# EAGLE design piezo_amplifier (EAGLE 9.3.0)
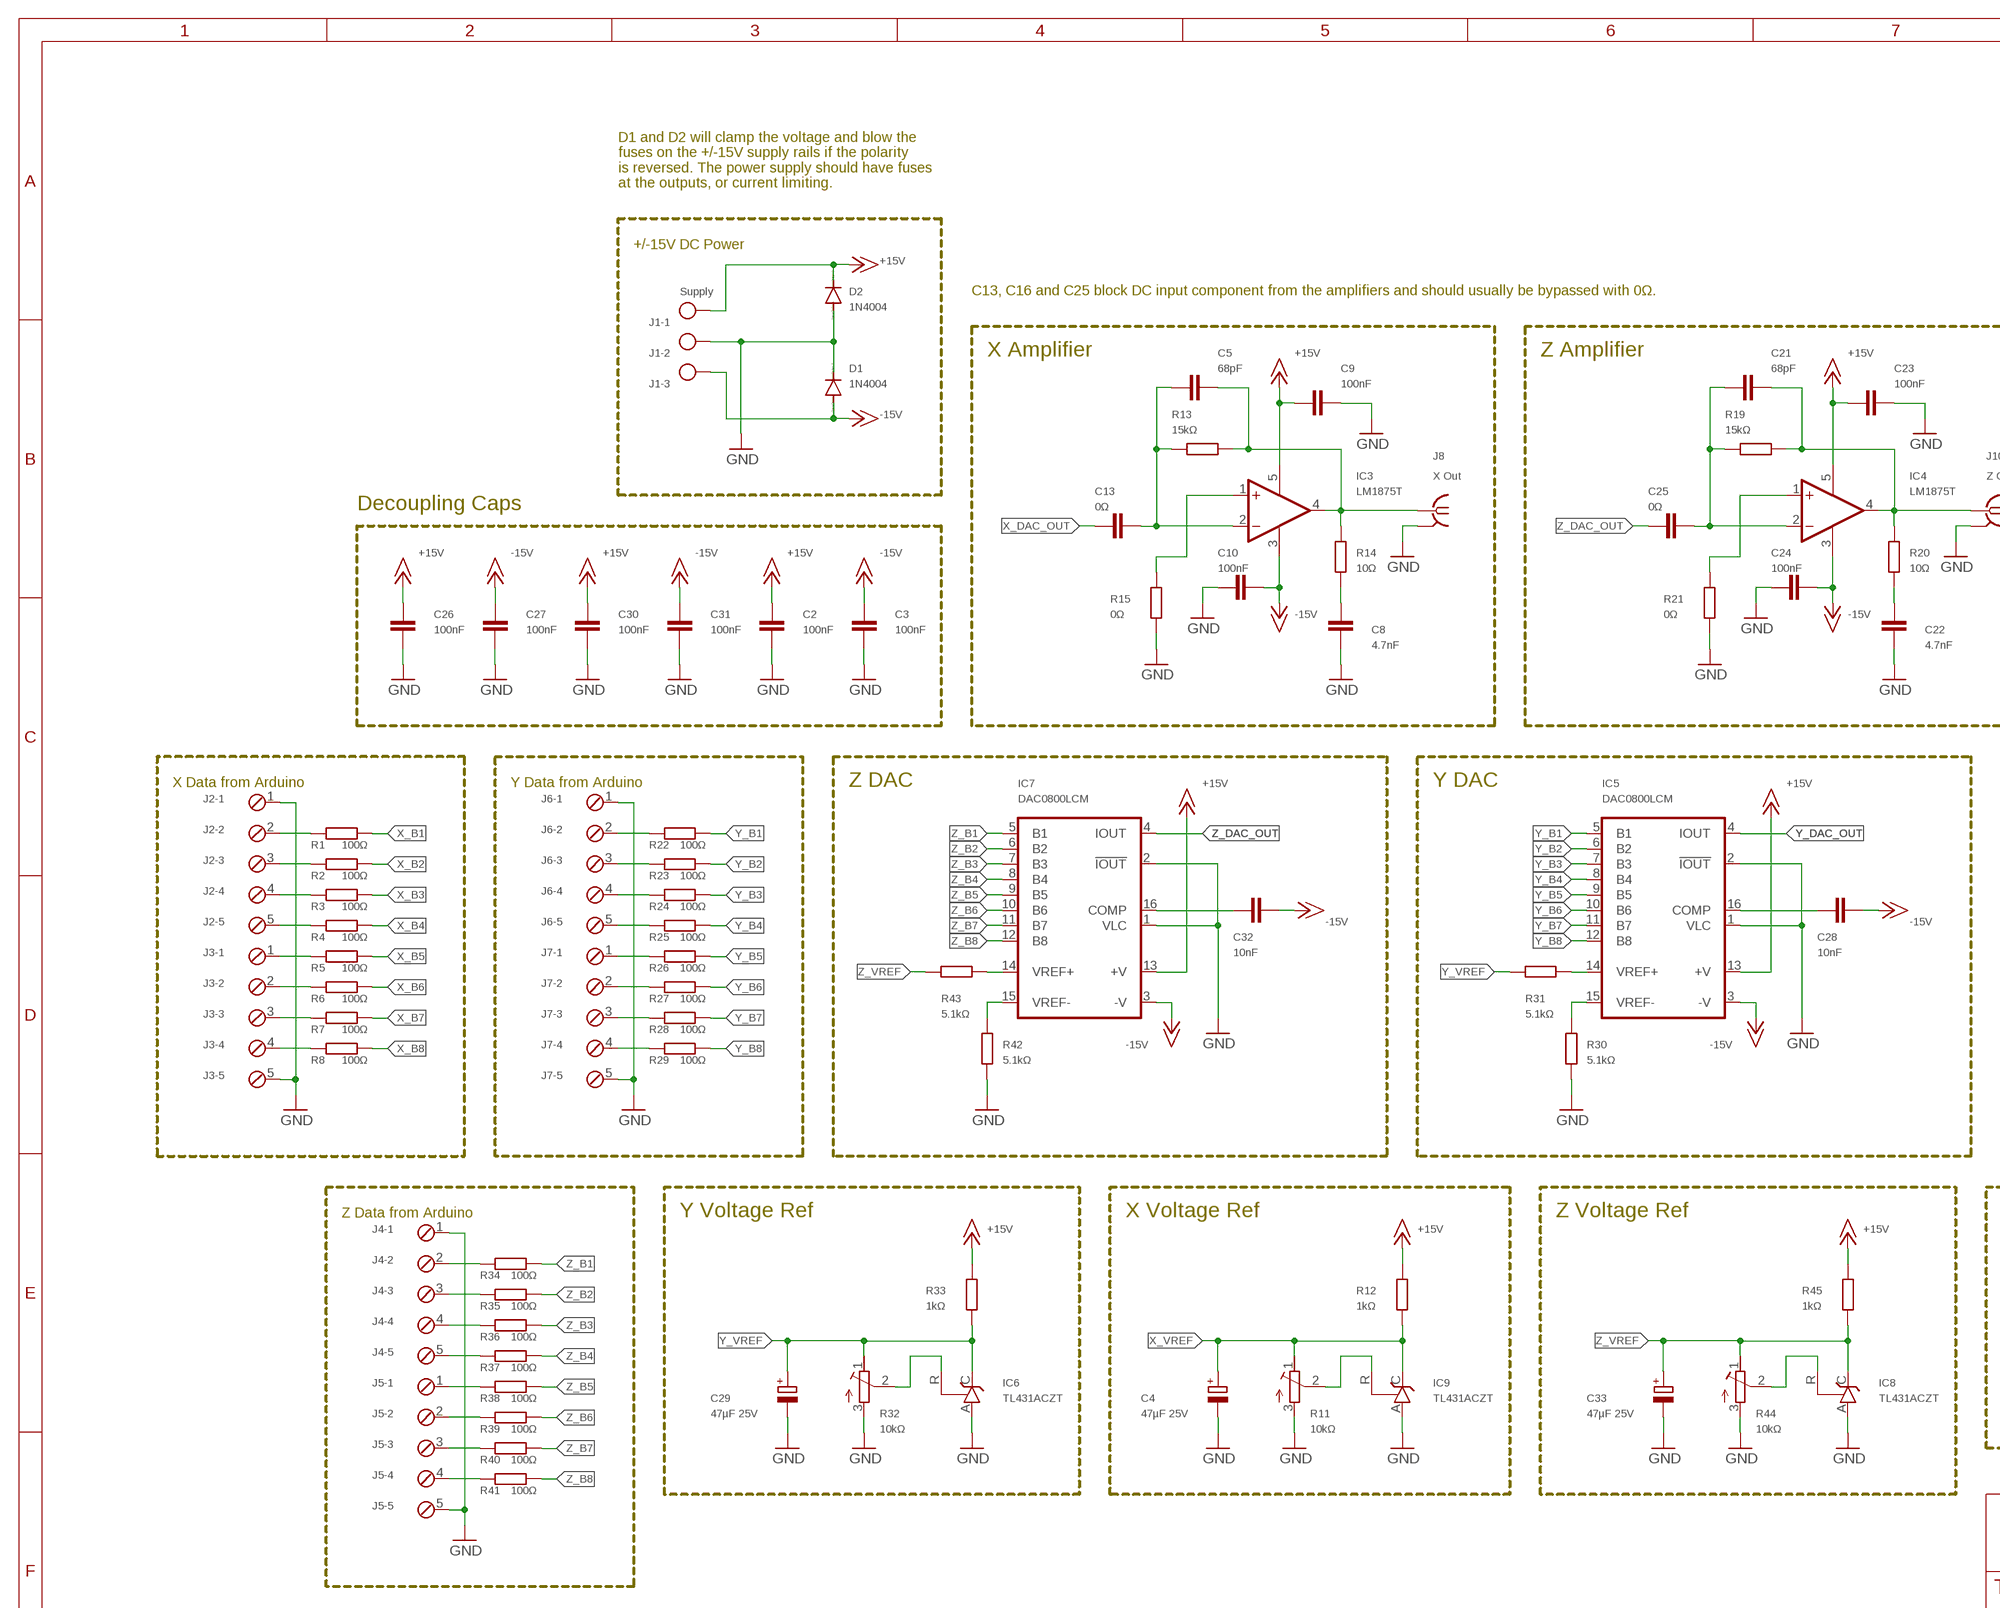
[diagram p0: schematic, sheet 1, part 1 of 3]
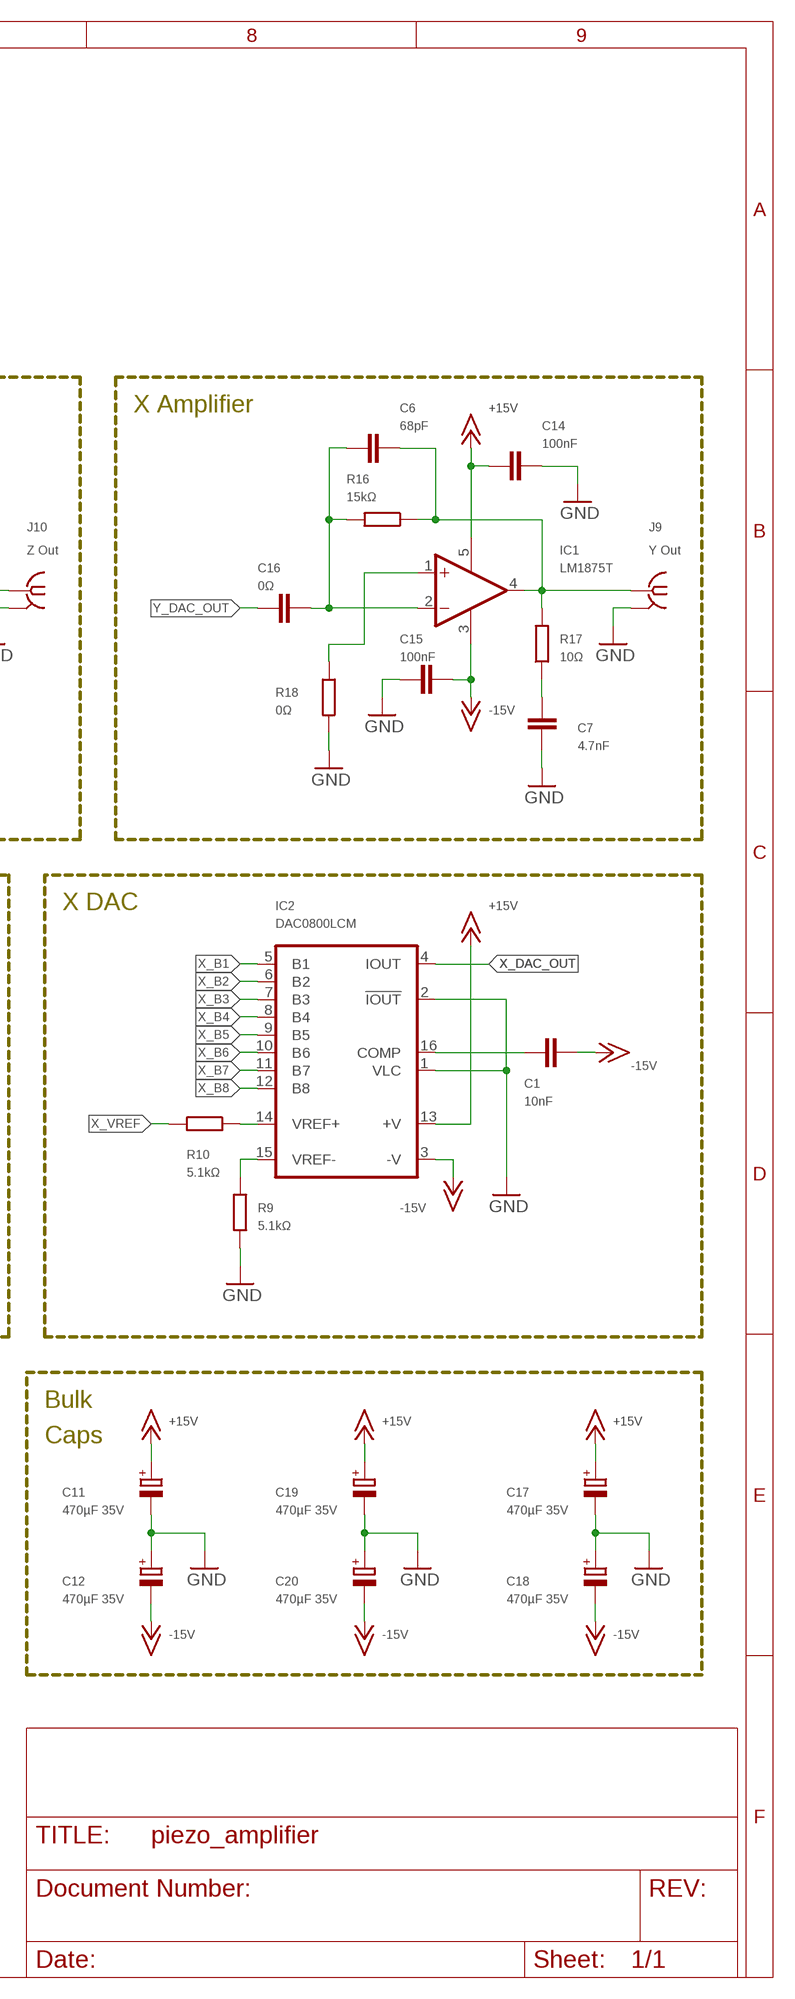
[diagram p1: schematic, sheet 1, part 2 of 3]
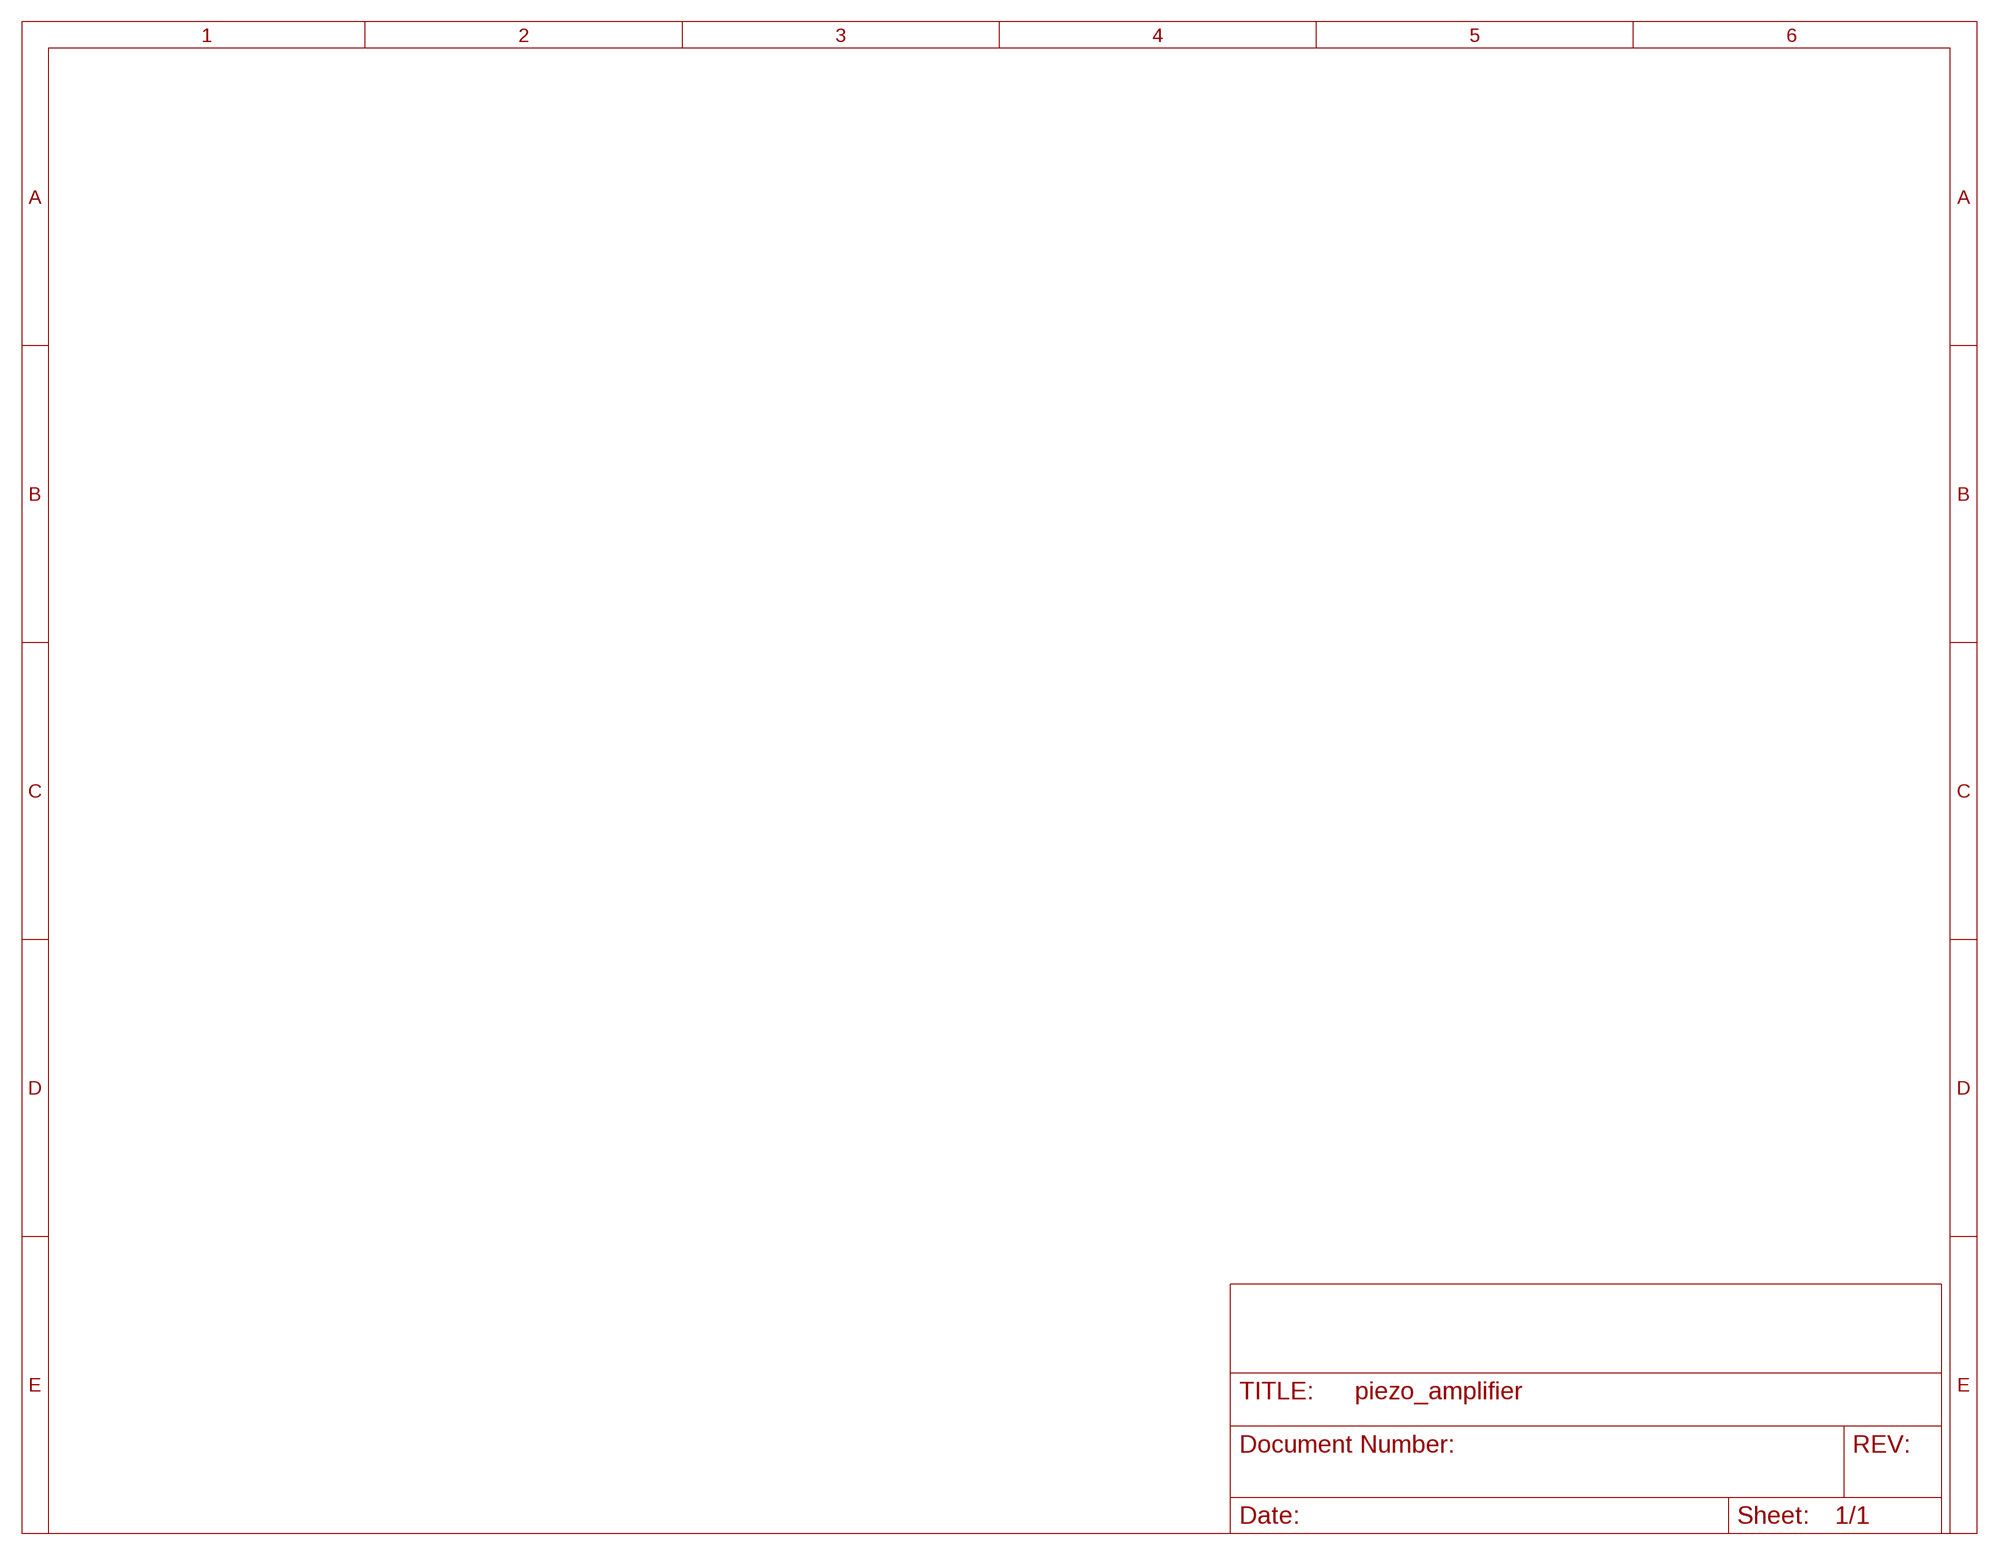
[diagram p2: schematic, sheet 1, part 3 of 3]

## Parts
C1  10nF  C-EU050-025X075  [C050-025X075]
C2  100nF  C-EU050-025X075  [C050-025X075]
C3  100nF  C-EU050-025X075  [C050-025X075]
C4  47µF 25V  CPOL-EUE2.5-5  [E2,5-5]
C5  68pF  C-EU050-025X075  [C050-025X075]
C6  68pF  C-EU050-025X075  [C050-025X075]
C7  4.7nF  C-EU050-025X075  [C050-025X075]
C8  4.7nF  C-EU050-025X075  [C050-025X075]
C9  100nF  C-EU050-025X075  [C050-025X075]
C10  100nF  C-EU050-025X075  [C050-025X075]
C11  470µF 35V  CPOL-EUE5-8.5  [E5-8,5]
C12  470µF 35V  CPOL-EUE5-8.5  [E5-8,5]
C13  0Ω  C-EU050-025X075  [C050-025X075]
C14  100nF  C-EU050-025X075  [C050-025X075]
C15  100nF  C-EU050-025X075  [C050-025X075]
C16  0Ω  C-EU050-025X075  [C050-025X075]
C17  470µF 35V  CPOL-EUE5-8.5  [E5-8,5]
C18  470µF 35V  CPOL-EUE5-8.5  [E5-8,5]
C19  470µF 35V  CPOL-EUE5-8.5  [E5-8,5]
C20  470µF 35V  CPOL-EUE5-8.5  [E5-8,5]
C21  68pF  C-EU050-025X075  [C050-025X075]
C22  4.7nF  C-EU050-025X075  [C050-025X075]
C23  100nF  C-EU050-025X075  [C050-025X075]
C24  100nF  C-EU050-025X075  [C050-025X075]
C25  0Ω  C-EU050-025X075  [C050-025X075]
C26  100nF  C-EU050-025X075  [C050-025X075]
C27  100nF  C-EU050-025X075  [C050-025X075]
C28  10nF  C-EU050-025X075  [C050-025X075]
C29  47µF 25V  CPOL-EUE2.5-5  [E2,5-5]
C30  100nF  C-EU050-025X075  [C050-025X075]
C31  100nF  C-EU050-025X075  [C050-025X075]
C32  10nF  C-EU050-025X075  [C050-025X075]
C33  47µF 25V  CPOL-EUE2.5-5  [E2,5-5]
D1  1N4004  [DO41-10]
D2  1N4004  [DO41-10]
IC1  LM1875T  [CB367]
IC2  DAC0800LCM  DAC0800D  [SO16]
IC3  LM1875T  [CB367]
IC4  LM1875T  [CB367]
IC5  DAC0800LCM  DAC0800D  [SO16]
IC6  TL431ACZT  TL431CLP  [TO92-CLP]
IC7  DAC0800LCM  DAC0800D  [SO16]
IC8  TL431ACZT  TL431CLP  [TO92-CLP]
IC9  TL431ACZT  TL431CLP  [TO92-CLP]
J1  Supply  MKDSN1,5/3-5,08  [MKDSN1,5/3-5,08]
J2  MPT5  [5POL254]
J3  MPT5  [5POL254]
J4  MPT5  [5POL254]
J5  MPT5  [5POL254]
J6  MPT5  [5POL254]
J7  MPT5  [5POL254]
J8  X Out  BU-SMA-V  [BU-SMA-V]
J9  Y Out  BU-SMA-V  [BU-SMA-V]
J10  Z Out  BU-SMA-V  [BU-SMA-V]
R1  100Ω  R-EU_0207/10  [0207/10]
R2  100Ω  R-EU_0207/10  [0207/10]
R3  100Ω  R-EU_0207/10  [0207/10]
R4  100Ω  R-EU_0207/10  [0207/10]
R5  100Ω  R-EU_0207/10  [0207/10]
R6  100Ω  R-EU_0207/10  [0207/10]
R7  100Ω  R-EU_0207/10  [0207/10]
R8  100Ω  R-EU_0207/10  [0207/10]
R9  5.1kΩ  R-EU_0207/10  [0207/10]
R10  5.1kΩ  R-EU_0207/10  [0207/10]
R11  10kΩ  R-TRIMMT93YA  [RTRIMT93YA]
R12  1kΩ  R-EU_0207/10  [0207/10]
R13  15kΩ  R-EU_0207/10  [0207/10]
R14  10Ω  R-EU_0207/10  [0207/10]
R15  0Ω  R-EU_0207/10  [0207/10]
R16  15kΩ  R-EU_0207/10  [0207/10]
R17  10Ω  R-EU_0207/10  [0207/10]
R18  0Ω  R-EU_0207/10  [0207/10]
R19  15kΩ  R-EU_0207/10  [0207/10]
R20  10Ω  R-EU_0207/10  [0207/10]
R21  0Ω  R-EU_0207/10  [0207/10]
R22  100Ω  R-EU_0207/10  [0207/10]
R23  100Ω  R-EU_0207/10  [0207/10]
R24  100Ω  R-EU_0207/10  [0207/10]
R25  100Ω  R-EU_0207/10  [0207/10]
R26  100Ω  R-EU_0207/10  [0207/10]
R27  100Ω  R-EU_0207/10  [0207/10]
R28  100Ω  R-EU_0207/10  [0207/10]
R29  100Ω  R-EU_0207/10  [0207/10]
R30  5.1kΩ  R-EU_0207/10  [0207/10]
R31  5.1kΩ  R-EU_0207/10  [0207/10]
R32  10kΩ  R-TRIMMT93YA  [RTRIMT93YA]
R33  1kΩ  R-EU_0207/10  [0207/10]
R34  100Ω  R-EU_0207/10  [0207/10]
R35  100Ω  R-EU_0207/10  [0207/10]
R36  100Ω  R-EU_0207/10  [0207/10]
R37  100Ω  R-EU_0207/10  [0207/10]
R38  100Ω  R-EU_0207/10  [0207/10]
R39  100Ω  R-EU_0207/10  [0207/10]
R40  100Ω  R-EU_0207/10  [0207/10]
R41  100Ω  R-EU_0207/10  [0207/10]
R42  5.1kΩ  R-EU_0207/10  [0207/10]
R43  5.1kΩ  R-EU_0207/10  [0207/10]
R44  10kΩ  R-TRIMMT93YA  [RTRIMT93YA]
R45  1kΩ  R-EU_0207/10  [0207/10]

## Nets
+15V: C2.2 C9.1 C11.+ C14.1 C17.+ C19.+ C23.1 C26.2 C30.2 D2.C IC1.5(V+) IC2.13(+V) IC3.5(V+) IC4.5(V+) IC5.13(+V) IC7.13(+V) J1.1 R12.2 R33.2 R45.2
-15V: C1.2 C3.2 C10.2 C12.- C15.2 C18.- C20.- C24.2 C27.2 C28.2 C31.2 C32.2 D1.A IC1.3(V-) IC2.3(-V) IC3.3(V-) IC4.3(V-) IC5.3(-V) IC7.3(-V) J1.3
FOO: C6.2 C16.1 IC1.2(-IN) R16.2
FOO1: C21.2 C25.1 IC4.2(-IN) R19.2
FOO2: C5.2 C13.1 IC3.2(-IN) R13.2
GND: C2.1 C3.1 C4.- C7.2 C8.2 C9.2 C10.1 C11.- C12.+ C14.2 C15.1 C17.- C18.+ C19.- C20.+ C22.2 C23.2 C24.1 C26.1 C27.1 C29.- C30.1 C31.1 C33.- D1.C D2.A IC2.1(VLC) IC2.2(!IOUT) IC5.1(VLC) IC5.2(!IOUT) IC6.A IC7.1(VLC) IC7.2(!IOUT) IC8.A IC9.A J1.2 J2.1 J3.5 J4.1 J5.5 J6.1 J7.5 J8.2 J8.3 J8.4 J8.5 J9.2 J9.3 J9.4 J9.5 J10.2 J10.3 J10.4 J10.5 R9.1 R11.3(A) R15.2 R18.2 R21.2 R30.1 R32.3(A) R42.1 R44.3(A)
N$1: IC9.R R11.2(S)
N$2: C5.1 IC3.4(OUT) J8.1 R13.1 R14.2
N$3: C6.1 IC1.4(OUT) J9.1 R16.1 R17.2
N$4: C8.1 R14.1
N$5: IC3.1(+IN) R15.1
N$6: C7.1 R17.1
N$7: IC1.1(+IN) R18.1
N$8: C21.1 IC4.4(OUT) J10.1 R19.1 R20.2
N$9: J2.3 R2.1
N$10: J2.2 R1.1
N$11: J2.4 R3.1
N$12: J2.5 R4.1
N$13: J3.1 R5.1
N$14: J3.2 R6.1
N$15: J3.3 R7.1
N$16: J3.4 R8.1
N$17: C22.1 R20.1
N$18: IC4.1(+IN) R21.1
N$19: J6.2 R22.1
N$20: J6.3 R23.1
N$21: J6.4 R24.1
N$22: J6.5 R25.1
N$23: J7.1 R26.1
N$24: J7.2 R27.1
N$25: C1.1 IC2.16(COMP)
N$26: J7.3 R28.1
N$27: J7.4 R29.1
N$28: IC2.14(VREF+) R10.1
N$29: IC2.15(VREF-) R9.2
N$30: C28.1 IC5.16(COMP)
N$31: IC5.14(VREF+) R31.1
N$32: IC5.15(VREF-) R30.2
N$33: IC6.R R32.2(S)
N$34: J4.2 R34.1
N$35: J4.3 R35.1
N$36: J4.4 R36.1
N$37: J4.5 R37.1
N$38: J5.1 R38.1
N$39: J5.2 R39.1
N$40: J5.3 R40.1
N$41: J5.4 R41.1
N$42: C32.1 IC7.16(COMP)
N$43: IC7.14(VREF+) R43.1
N$44: IC7.15(VREF-) R42.2
N$45: IC8.R R44.2(S)
X_B1: IC2.5(B1) R1.2
X_B2: IC2.6(B2) R2.2
X_B3: IC2.7(B3) R3.2
X_B4: IC2.8(B4) R4.2
X_B5: IC2.9(B5) R5.2
X_B6: IC2.10(B6) R6.2
X_B7: IC2.11(B7) R7.2
X_B8: IC2.12(B8) R8.2
X_DAC_OUT: C13.2 IC2.4(IOUT)
X_VREF: C4.+ IC9.C R10.2 R11.1(E) R12.1
Y_B1: IC5.5(B1) R22.2
Y_B2: IC5.6(B2) R23.2
Y_B3: IC5.7(B3) R24.2
Y_B4: IC5.8(B4) R25.2
Y_B5: IC5.9(B5) R26.2
Y_B6: IC5.10(B6) R27.2
Y_B7: IC5.11(B7) R28.2
Y_B8: IC5.12(B8) R29.2
Y_DAC_OUT: C16.2 IC5.4(IOUT)
Y_VREF: C29.+ IC6.C R31.2 R32.1(E) R33.1
Z_B1: IC7.5(B1) R34.2
Z_B2: IC7.6(B2) R35.2
Z_B3: IC7.7(B3) R36.2
Z_B4: IC7.8(B4) R37.2
Z_B5: IC7.9(B5) R38.2
Z_B6: IC7.10(B6) R39.2
Z_B7: IC7.11(B7) R40.2
Z_B8: IC7.12(B8) R41.2
Z_DAC_OUT: C25.2 IC7.4(IOUT)
Z_VREF: C33.+ IC8.C R43.2 R44.1(E) R45.1

## Notes on the sheet
- D1 and D2 will clamp the voltage and blow the
  fuses on the +/-15V supply rails if the polarity
  is reversed. The power supply should have fuses
  at the outputs, or current limiting.
- +/-15V DC Power
- C13, C16 and C25 block DC input component from the amplifiers and should usually be bypassed with 0Ω.
- X Amplifier | Z Amplifier | X Amplifier
- Decoupling Caps
- X Data from Arduino | Y Data from Arduino | Z DAC | Y DAC | X DAC
- Z Data from Arduino | Y Voltage Ref | X Voltage Ref | Z Voltage Ref | Bulk
- Caps

## Library data of the parts
C1-C3 C5-C10 C13-C16 C21-C28 C30-C32 = piezo_amplifier:C-EU: CAPACITOR, European symbol; SPICEPREFIX: C
C4 C11 C12 C17-C20 C29 C33 = piezo_amplifier:CPOL-EU: POLARIZED CAPACITOR, European symbol; SPICEPREFIX: C
D1 D2 = piezo_amplifier:1N4004: DIODE general purpose rectifier, 1 A
IC1 IC3 IC4 = piezo_amplifier:LM1875T: Power OP AMP
IC2 IC5 IC7 = piezo_amplifier:DAC0800: 8-bit DIGITAL/ANALOG CONVERTER
IC6 IC8 IC9 = piezo_amplifier:TL431CLP: VOLTAGE REGULATOR
J1 = piezo_amplifier:MKDSN1,5/3-5,08: MKDSN 1,5/ 3-5,08 Printklemme Nennstrom: 13,5 A Nennspannung: 250 V Rastermaß: 5,08 mm Polzahl: 3 Anschlussart: Schraubanschluss Montage: Löten Anschlussrichtung Leiter/Platine: 0 ° Artikelnummer: 1729131 Source: http://eshop.phoenixcontact.com .. 1729131.pdf
J2-J7 = piezo_amplifier:MPT5: PHOENIX CONNECTOR; OC_FARNELL: unknown; OC_NEWARK: unknown
J8-J10 = con-coax:BU-SMA-V: FEMALE SMA CONNECTOR Radiall distributor RS 112-3794; OC_FARNELL: unknown; OC_NEWARK: unknown
R1-R10 R12-R31 R33-R43 R45 = piezo_amplifier:R-EU_: RESISTOR, European symbol; SPICEPREFIX: R
R11 R32 R44 = piezo_amplifier:R-TRIMM: Trimm resistor; SPICEMODEL: X; SPICEPREFIXL: POT

## Board
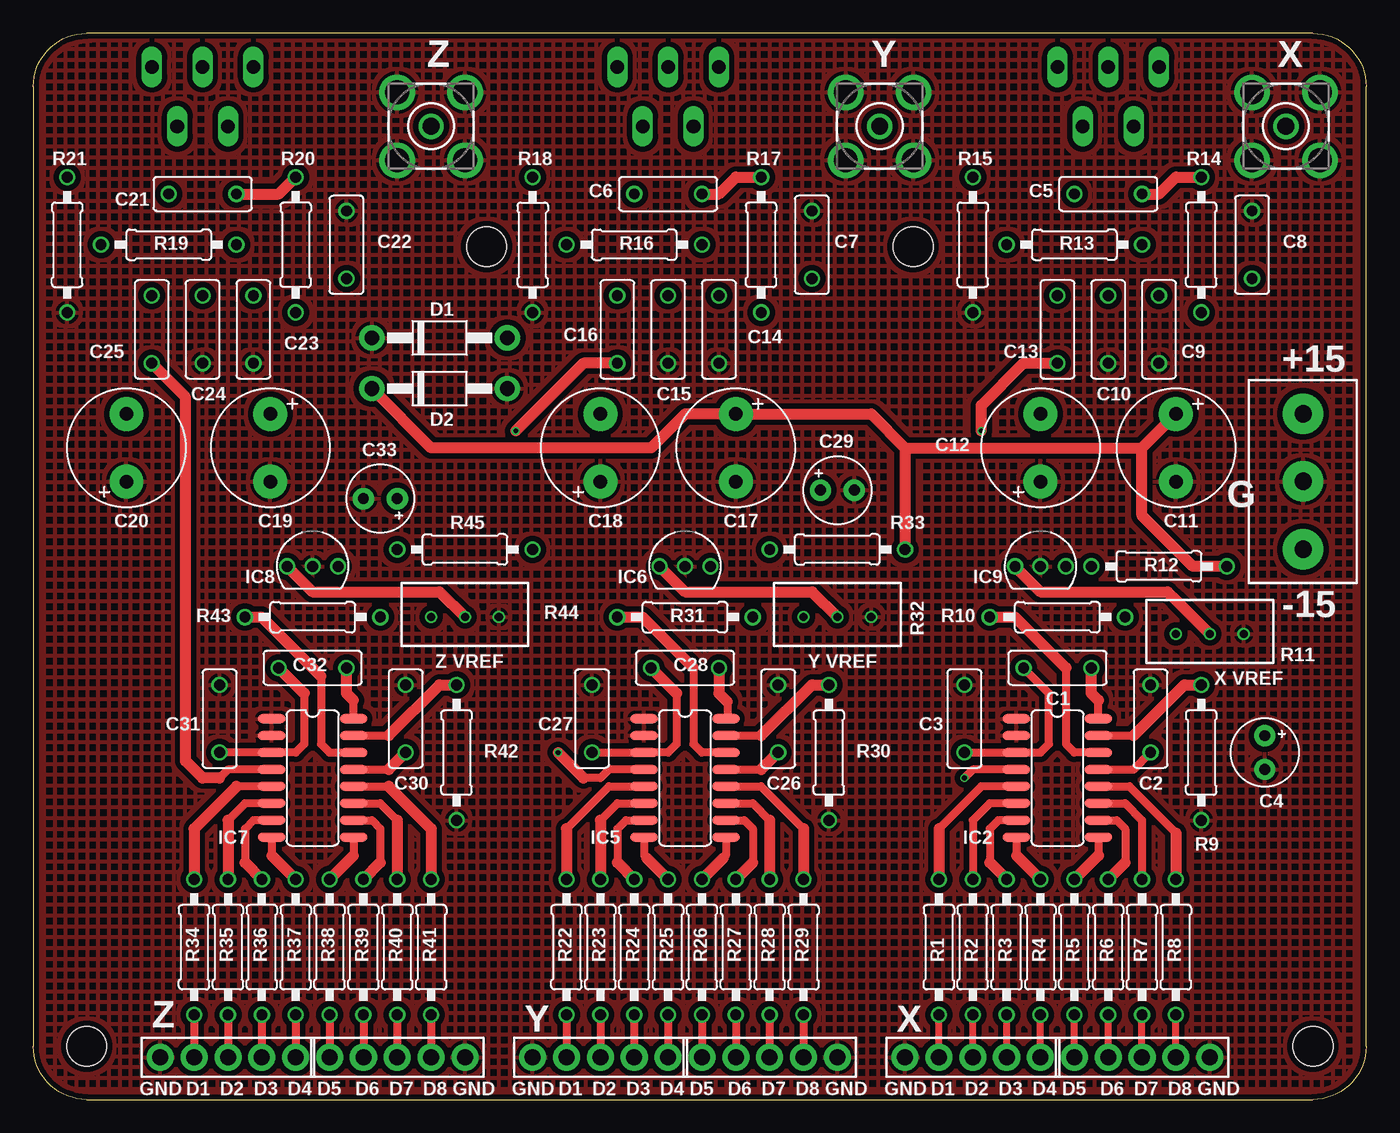
[diagram p3: board, top side]
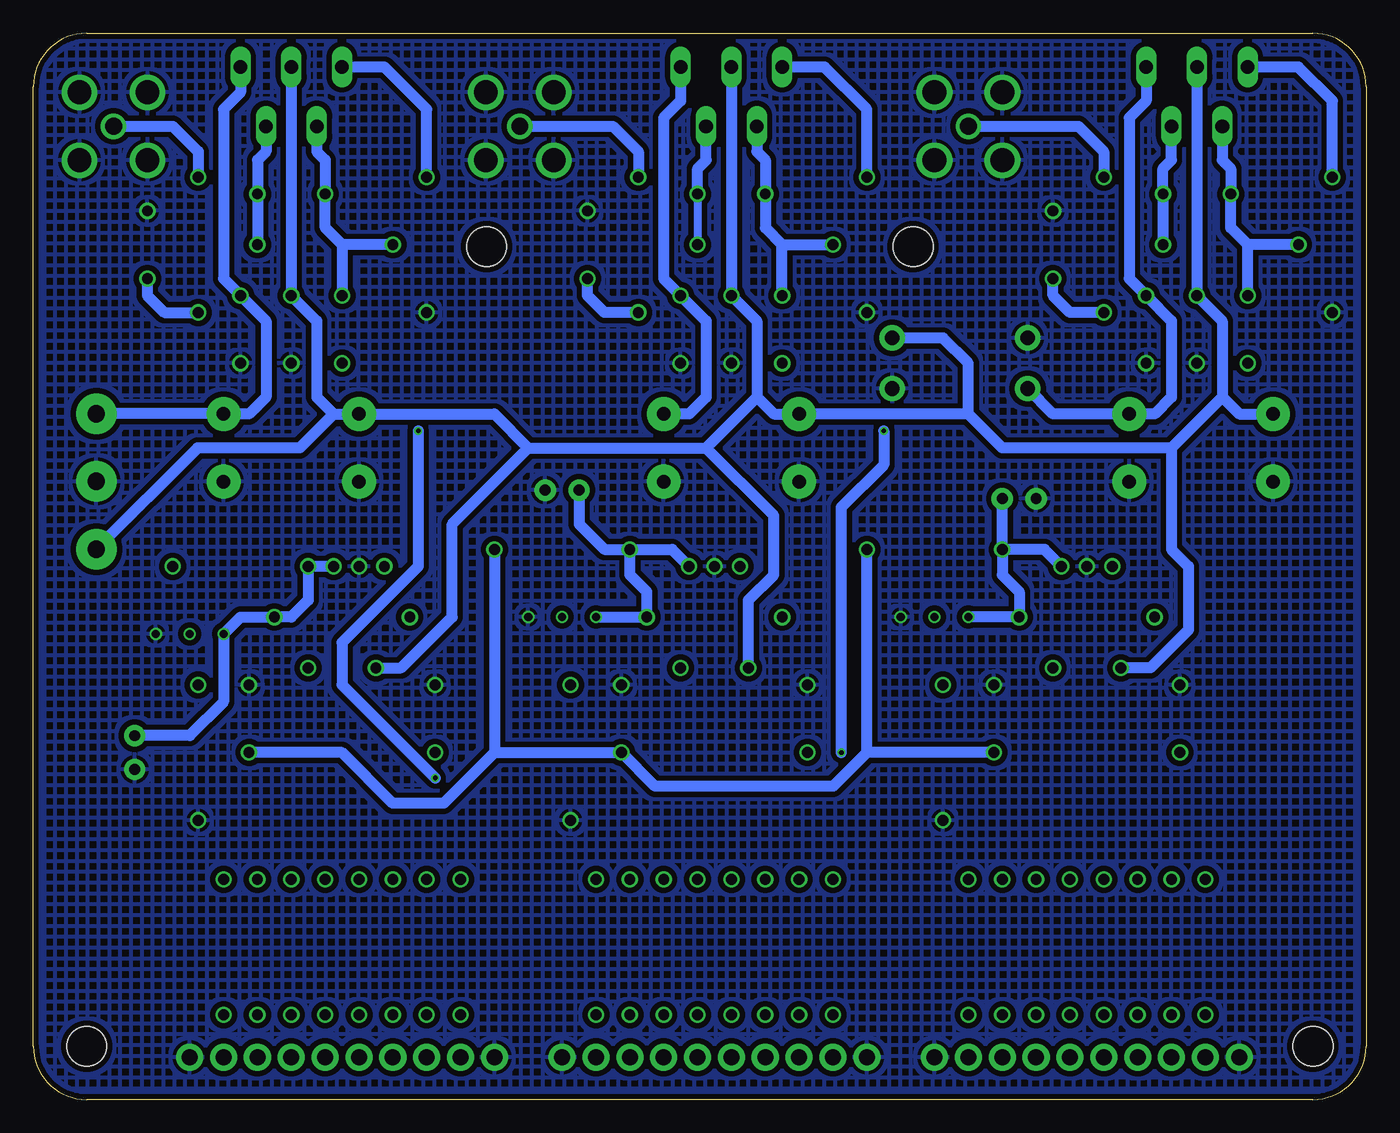
[diagram p4: board, bottom side, seen from below]

Size 100 x 80 mm. Coordinates in mm from the lower left corner, seen from the top.
Outline: 4,0 96,0 arc90 100,4 100,76 arc90 96,80 4,80 arc90 0,76 0,4 arc90 4,0
Copper layers (1*16): Top 0.035559375mm / dielectric 1.6mm / Bottom 0.035559375mm
Design rules "oshpark-2layer": minimum track width 6mil, minimum drill 10mil, track to track 6mil, track to pad 6mil, pad to pad 6mil, via to via 6mil, smd to smd 6mil, copper to edge 15mil, drill to drill 6mil, minimum pad ring 5mil, minimum via ring 5mil, stop-mask expansion 2.5mil, vias tented up to drill 0mil, thermal gap 10mil
Holes 3 mm at 34,64 96,4 4,4 66,64

### Footprints (pad centres in the part's own frame; a part is rotated, then mirrored left to right if it is on the bottom)
C050-025X075 = drill 0.813: 1 -2.54,0; 2 2.54,0
E2,5-5 = drill 0.813 pad 1.6: + -1.27,0; - 1.27,0
E5-8,5 = drill 1.016 pad 2.54: + -2.54,0; - 2.54,0
DO41-10 = drill 1.118 pad 1.905: A 5.08,0; C -5.08,0
CB367 = drill 1.016 long: 1 -3.81,-6.985; 2 -1.905,-11.43; 3 0,-6.985; 4 1.905,-11.43; 5 3.81,-6.985
SO16 = smd 0.66 x 2.032: 1 -4.445,-3.073; 2 -3.175,-3.073; 3 -1.905,-3.073; 4 -0.635,-3.073; 5 0.635,-3.073; 6 1.905,-3.073; 7 3.175,-3.073; 8 4.445,-3.073; 9 4.445,3.073; 10 3.175,3.073; 11 1.905,3.073; 12 0.635,3.073; 13 -0.635,3.073; 14 -1.905,3.073; 15 -3.175,3.073; 16 -4.445,3.073
TO92-CLP = drill 0.813: A 0,0; C 1.905,0; R -1.905,0
MKDSN1,5/3-5,08 = drill 1.3 pad 3.048: 1 -7.641,0.025; 2 -2.561,0.025; 3 2.519,0.025
5POL254 = drill 1.2 pad 2.032: 1 -5.08,0; 2 -2.54,0; 3 0,0; 4 2.54,0; 5 5.08,0
BU-SMA-V = drill 1.27: 1 0,0 | drill 1.778: 2 -2.55,2.55; 3 2.55,2.55; 4 2.55,-2.55; 5 -2.55,-2.55
0207/10 = drill 0.813: 1 -5.08,0; 2 5.08,0
RTRIMT93YA = drill 0.61: 1 0,-2.54; 2 0,0; 3 0,2.54

### Placement (x,y rotation side)
C1  76.83,32.38 180 top
C2  83.82,28.57 270 top
C3  69.85,28.57 270 top
C4  92.39,26.04 270 top
C5  80.64,67.94 180 top
C6  47.62,67.94 180 top
C7  58.42,64.14 90 top
C8  91.44,64.14 90 top
C9  84.45,57.78 270 top
C10  80.64,57.78 90 top
C11  85.72,48.9 270 top
C12  75.56,48.9 90 top
C13  76.83,57.78 270 top
C14  51.44,57.78 270 top
C15  47.62,57.78 90 top
C16  43.81,57.78 270 top
C17  52.7,48.9 270 top
C18  42.55,48.9 90 top
C19  17.78,48.9 270 top
C20  6.99,48.9 90 top
C21  12.7,67.94 180 top
C22  23.5,64.14 90 top
C23  16.51,57.78 270 top
C24  12.7,57.78 90 top
C25  8.89,57.78 270 top
C26  55.88,28.57 270 top
C27  41.91,28.57 270 top
C28  48.9,32.38 180 top
C29  60.33,45.72 0 top
C30  27.94,28.57 270 top
C31  13.97,28.57 270 top
C32  20.95,32.38 180 top
C33  26.04,45.09 180 top
D1  30.48,57.15 0 top
D2  30.48,53.34 0 top
IC1  47.62,84.45 0 top
IC2  76.83,24.13 270 top
IC3  80.64,84.45 0 top
IC4  12.7,84.45 0 top
IC5  48.9,24.13 270 top
IC6  48.9,40.01 0 top
IC7  20.95,24.13 270 top
IC8  20.95,40.01 0 top
IC9  75.56,40.01 0 top
J1  95.25,43.81 270 top
J2  70.48,3.17 0 top
J3  83.19,3.17 0 top
J4  14.61,3.17 0 top
J5  27.3,3.17 0 top
J6  42.55,3.17 0 top
J7  55.24,3.17 0 top
J8  93.98,73.03 0 top
J9  63.5,73.03 0 top
J10  29.84,73.03 0 top
R1  67.94,11.43 90 top
R2  70.48,11.43 90 top
R3  73.03,11.43 90 top
R4  75.56,11.43 90 top
R5  78.11,11.43 90 top
R6  80.64,11.43 90 top
R7  83.19,11.43 90 top
R8  85.72,11.43 90 top
R9  87.63,26.04 90 top
R10  76.83,36.2 0 top
R11  88.27,34.92 270 top
R12  84.45,40.01 0 top
R13  78.11,64.14 180 top
R14  87.63,64.14 90 top
R15  70.48,64.14 270 top
R16  45.09,64.14 180 top
R17  54.61,64.14 90 top
R18  37.47,64.14 270 top
R19  10.16,64.14 180 top
R20  19.68,64.14 90 top
R21  2.54,64.14 270 top
R22  40.01,11.43 90 top
R23  42.55,11.43 90 top
R24  45.09,11.43 90 top
R25  47.62,11.43 90 top
R26  50.16,11.43 90 top
R27  52.7,11.43 90 top
R28  55.24,11.43 90 top
R29  57.78,11.43 90 top
R30  59.69,26.04 90 top
R31  48.9,36.2 0 top
R32  60.33,36.2 270 top
R33  60.33,41.27 0 top
R34  12.06,11.43 90 top
R35  14.61,11.43 90 top
R36  17.14,11.43 90 top
R37  19.68,11.43 90 top
R38  22.23,11.43 90 top
R39  24.77,11.43 90 top
R40  27.3,11.43 90 top
R41  29.84,11.43 90 top
R42  31.75,26.04 90 top
R43  20.95,36.2 0 top
R44  32.38,36.2 270 top
R45  32.38,41.27 0 top

### Tracks (layer width: path | path; a pad name or v marks a point on that pad's centre or on a via)
+15V
  Top 0.61: IC2.13 82.55,24.77 C2.2 | IC5.13 54.61,24.77 | IC7.13 26.67,24.77
  Top 0.813: D2.C 29.84,48.9 46.35,48.9 48.9,51.44 C17.+ 62.87,51.44 65.41,48.9 | 65.41,48.9 83.19,48.9 | 83.19,48.9 C11.+ | 54.61,24.77 C26.2 | 26.67,24.77 C30.2 | R12.2 87,40.01 83.19,43.81 83.19,48.9 | 65.41,48.9 R33.2
  Bottom 0.61: C11.+ 85.75,51.46
  Bottom 0.813: C11.+ 83.82,51.44 82.55,52.7 82.55,58.42 C9.1 85.72,61.59 85.72,74.3 84.45,75.56 IC3.5 | C17.+ 50.8,51.44 49.53,52.7 49.53,58.42 C14.1 52.7,61.59 52.7,73.66 51.44,74.93 IC1.5 | 85.75,51.46 J1.1 | C30.2 37.47,26.04 | 37.47,26.04 40.01,23.5 53.34,23.5 C26.2 65.41,26.04 | 37.47,26.04 R45.2 | R33.2 65.41,26.04 | 65.41,26.04 69.22,22.23 73.03,22.23 76.83,26.04 C2.2 | D2.C 23.5,51.44 C19.+ 15.88,51.44 14.61,52.7 14.61,58.42 C23.1 17.78,61.59 17.78,73.66 16.51,74.93 IC4.5
-15V
  Top 0.61: C1.2 76.2,30.48 76.2,26.67 75.56,26.04 IC2.3 C3.2 | C27.2 IC5.3 47.62,26.04 48.26,26.67 48.26,30.48 | C31.2 IC7.3 19.68,26.04 20.32,26.67 20.32,30.48
  Top 0.813: C28.2 48.26,30.48 | C32.2 20.32,30.48
  Bottom 0.813: IC3.3 C10.2 78.74,58.42 78.74,52.7 77.47,51.44 | 77.47,51.44 C12.- 65.41,51.44 62.87,48.9 | IC1.3 C15.2 45.72,58.42 45.72,52.7 | 45.72,52.7 44.45,51.44 C18.- 29.84,51.44 | 10.79,52.7 9.53,51.44 C20.- | 10.79,52.7 10.79,58.42 C24.2 IC4.3 | 10.79,52.7 14.61,48.9 | 29.84,51.44 27.3,48.9 14.61,48.9 | 45.72,52.7 49.53,48.9 | 62.87,48.9 49.53,48.9 | 77.47,51.44 80.01,48.9 87.68,48.9 J1.3 | C1.2 72.39,32.38 68.58,36.2 68.58,43.18 62.87,48.9 | 14.61,48.9 14.61,41.27 13.34,40.01 13.34,35.24 16.19,32.38 C32.2 | C28.2 46.35,37.47 44.45,39.37 44.45,43.81 49.53,48.9 | 29.84,51.44 29.84,55.24 31.75,57.15 D1.A
FOO
  Bottom 0.813: IC1.2 45.72,71.12 45.09,70.48 C6.2 45.09,65.41 43.81,64.14 | 43.81,64.14 R16.2 | C16.1 43.81,64.14
FOO1
  Bottom 0.813: C25.1 8.89,64.14 | 8.89,64.14 10.16,65.41 C21.2 10.16,69.85 10.79,70.48 IC4.2 | R19.2 8.89,64.14
FOO2
  Bottom 0.813: IC3.2 78.74,71.12 78.11,70.48 C5.2 78.11,65.41 76.83,64.14 | R13.2 76.83,64.14 | 76.83,64.14 C13.1
GND
  pour Top (isolate 0.406, hatched): 0,80 100,80 100,0 0,0
  pour Bottom (isolate 0.406, hatched): 0,80 100,80 100,0 0,0
N$1
  Top 0.813: R11.2 85.72,37.47 85.09,38.1 75.56,38.1 IC9.R
N$2
  Top 0.813: C5.1 84.45,67.94 85.72,69.22 R14.2
  Bottom 0.813: IC3.4 82.55,71.12 83.19,70.48 C5.1 R13.1 | J8.1 89.53,73.03 87.63,71.12 R14.2
N$3
  Top 0.813: C6.1 51.44,67.94 52.7,69.22 R17.2
  Bottom 0.61: C6.1 R16.1
  Bottom 0.813: C6.1 50.16,69.85 49.53,70.48 IC1.4 | J9.1 56.52,73.03 54.61,71.12 R17.2
N$4
  Bottom 0.813: C8.1 91.44,60.33 90.17,59.05 R14.1
N$5
  Bottom 0.813: R15.1 70.48,74.3 73.66,77.47 IC3.1
N$6
  Bottom 0.813: R17.1 57.15,59.05 58.42,60.33 C7.1
N$7
  Bottom 0.813: R18.1 37.47,74.3 40.64,77.47 IC1.1
N$8
  Top 0.813: C21.1 18.41,67.94 R20.2
  Bottom 0.813: R19.1 C21.1 15.24,69.85 14.61,70.48 IC4.4 | J10.1 21.59,73.03 19.68,71.12 R20.2
N$9
  Top 0.508: J2.3 R2.1
N$10
  Top 0.508: J2.2 R1.1
N$11
  Top 0.508: J2.4 R3.1
N$12
  Top 0.508: J2.5 R4.1
N$13
  Top 0.508: J3.1 R5.1
N$14
  Top 0.508: J3.2 R6.1
N$15
  Top 0.508: J3.3 R7.1
N$16
  Top 0.508: J3.4 R8.1
N$17
  Bottom 0.813: R20.1 22.23,59.05 23.5,60.33 C22.1
N$18
  Bottom 0.813: R21.1 2.54,74.93 5.08,77.47 IC4.1
N$19
  Top 0.61: R22.1 J6.2
N$20
  Top 0.61: R23.1 J6.3
N$21
  Top 0.61: R24.1 J6.4
N$22
  Top 0.61: R25.1 J6.5
N$23
  Top 0.61: R26.1 J7.1
N$24
  Top 0.61: R27.1 J7.2
N$25
  Top 0.61: IC2.16 79.91,29.95
  Top 0.813: 79.91,29.95 79.38,30.48 C1.1
N$26
  Top 0.61: R28.1 J7.3
N$27
  Top 0.61: R29.1 J7.4
N$28
  Top 0.61: IC2.14 78.11,26.04 77.47,26.67 77.47,32.38
  Top 0.813: R10.1 73.66,36.2 77.47,32.38
N$29
  Top 0.61: IC2.15 82.55,27.3
  Top 0.813: 82.55,27.3 86.36,31.11 R9.2
N$30
  Top 0.61: 52.07,29.84 52.07,28.68 IC5.16
  Top 0.813: C28.1 51.44,30.48 52.07,29.84
N$31
  Top 0.61: IC5.14 50.16,26.04 49.53,26.67 49.53,32.38
  Top 0.813: R31.1 45.72,36.2 49.53,32.38
N$32
  Top 0.61: IC5.15 54.61,27.3
  Top 0.813: 54.61,27.3 58.42,31.11 R30.2
N$33
  Top 0.813: R32.2 58.42,38.1 48.9,38.1 IC6.R
N$34
  Top 0.61: R34.1 J4.2
N$35
  Top 0.61: R35.1 J4.3
N$36
  Top 0.61: R36.1 J4.4
N$37
  Top 0.61: R37.1 J4.5
N$38
  Top 0.61: R38.1 J5.1
N$39
  Top 0.61: R39.1 J5.2
N$40
  Top 0.61: R40.1 J5.3
N$41
  Top 0.61: R41.1 J5.4
N$42
  Top 0.61: IC7.16 24.03,29.95
  Top 0.813: 24.03,29.95 23.5,30.48 C32.1
N$43
  Top 0.61: 21.59,31.75 21.59,26.67 22.23,26.04 IC7.14
  Top 0.813: R43.1 17.14,36.2 21.59,31.75
N$44
  Top 0.61: IC7.15 26.67,27.3
  Top 0.813: 26.67,27.3 30.48,31.11 R42.2
N$45
  Top 0.813: R44.2 30.48,38.1 20.95,38.1 IC8.R
X_B1
  Top 0.61: IC2.5 71.12,23.5 67.94,20.32
  Top 0.813: 67.94,20.32 R1.2
X_B2
  Top 0.61: IC2.6 71.75,22.23 70.48,20.95 R2.2
X_B3
  Top 0.61: IC2.7 72.39,20.95 71.75,20.32 71.75,17.78
  Top 0.813: 71.75,17.78 R3.2
X_B4
  Top 0.61: IC2.8 73.76,18.31
  Top 0.813: R4.2 73.76,18.31
X_B5
  Top 0.61: IC2.9 79.91,18.31
  Top 0.813: 79.91,18.31 R5.2
X_B6
  Top 0.61: IC2.10 81.28,20.95 81.92,20.32 81.92,17.78
  Top 0.813: 81.92,17.78 R6.2
X_B7
  Top 0.61: IC2.11 81.92,22.23 83.19,20.95 R7.2
X_B8
  Top 0.61: IC2.12 82.23,23.5 85.72,20
  Top 0.813: 85.72,20 R8.2
X_DAC_OUT  (via drill 0.35)
  Top 0.61: IC2.4 70.48,24.77 v69.85,24.13
  Top 0.813: v71.12,50.16 71.12,52.07 74.3,55.24 C13.2
  Bottom 0.813: v69.85,24.13 76.83,31.11 76.83,34.29 71.12,40.01 v71.12,50.16
X_VREF
  Bottom 0.813: IC9.C R12.1 79.38,37.47 80.64,36.2 R10.2 84.45,36.2 R11.1 85.72,29.84 88.27,27.3 C4.+
Y_B1
  Top 0.61: 40.01,20.32 43.18,23.5 IC5.5
  Top 0.813: 40.01,20.32 R22.2
Y_B2
  Top 0.61: 42.55,20.95 43.81,22.23 IC5.6
  Top 0.813: 42.55,20.95 R23.2
Y_B3
  Top 0.61: 43.81,17.78 43.81,20.32 44.45,20.95 IC5.7
  Top 0.813: 43.81,17.78 R24.2
Y_B4
  Top 0.61: IC5.8 45.82,18.31 46.04,18.1
  Top 0.813: 46.04,18.1 R25.2
Y_B5
  Top 0.61: IC5.9 51.97,18.31 51.75,18.1
  Top 0.813: 51.75,18.1 R26.2
Y_B6
  Top 0.61: 53.98,17.78 53.98,20.32 53.34,20.95 IC5.10
  Top 0.813: 53.98,17.78 R27.2
Y_B7
  Top 0.61: 55.24,20.95 53.98,22.23 IC5.11
  Top 0.813: 55.24,20.95 R28.2
Y_B8
  Top 0.61: 57.78,20.32 54.61,23.5 IC5.12
  Top 0.813: 57.78,20.32 R29.2
Y_DAC_OUT  (via drill 0.35)
  Top 0.61: IC5.4 43.18,24.77 42.55,24.13 41.27,24.13
  Top 0.813: C16.2 41.27,55.24 v36.2,50.16 | 41.27,24.13 v39.37,26.04
  Bottom 0.813: v36.2,50.16 36.2,47.62 39.37,44.45 v39.37,26.04
Y_VREF
  Bottom 0.813: R33.1 55.24,39.37 53.98,38.1 R31.2 R32.1 | C29.+ 59.05,43.18 57.15,41.27 R33.1 | R33.1 52.07,41.27 IC6.C
Z_B1
  Top 0.61: IC7.5 15.24,23.5
  Top 0.813: 15.24,23.5 12.06,20.32 R34.2
Z_B2
  Top 0.61: IC7.6 15.88,22.23 14.61,20.95
  Top 0.813: 14.61,20.95 R35.2
Z_B3
  Top 0.61: IC7.7 16.51,20.95 15.88,20.32 15.88,17.78
  Top 0.813: 15.88,17.78 R36.2
Z_B4
  Top 0.61: IC7.8 17.88,18.31
  Top 0.813: 17.88,18.31 R37.2
Z_B5
  Top 0.61: IC7.9 24.03,18.31
  Top 0.813: 24.03,18.31 R38.2
Z_B6
  Top 0.61: IC7.10 25.4,20.95 26.04,20.32 26.04,17.78
  Top 0.813: 26.04,17.78 R39.2
Z_B7
  Top 0.61: IC7.11 26.04,22.23 27.3,20.95
  Top 0.813: 27.3,20.95 R40.2
Z_B8
  Top 0.61: IC7.12 26.67,23.5
  Top 0.813: 26.67,23.5 29.84,20.32 R41.2
Z_DAC_OUT
  Top 0.61: IC7.4 14.61,24.77 13.97,24.13
  Top 0.813: 13.97,24.13 12.7,24.13 11.43,25.4 11.43,52.7 C25.2
Z_VREF
  Bottom 0.813: R44.1 R43.2 26.04,38.1 27.3,39.37 R45.1 | R45.1 C33.+ | IC8.C 24.13,41.27 R45.1

### Text on the board
tPlace: Z | Y | X | +15 | G | -15 | Z VREF | Y VREF | X VREF | Z | Y | X | GND | D1 | D2 | D3 | D4 | D5 | D6 | D7 | D8 | GND | GND | D1 | D2 | D3 | D4 | D5 | D6 | D7 | D8 | GND | GND | D1 | D2 | D3 | D4 | D5 | D6 | D7 | D8 | GND